# EAGLE design LCD_Disp_AIR (EAGLE 6.5.0)
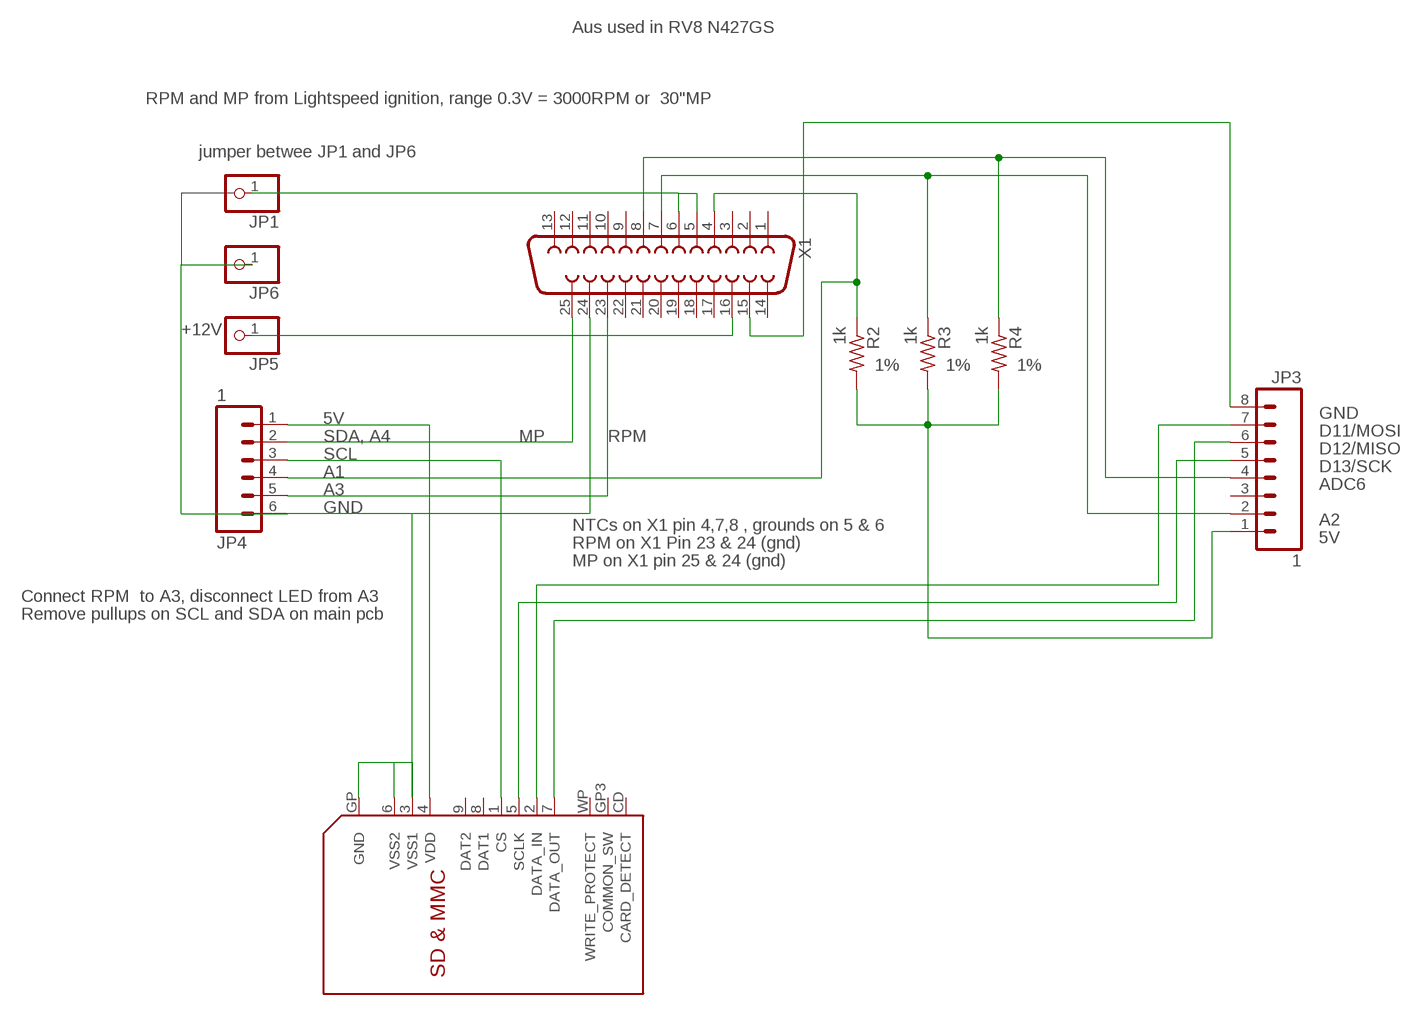
[diagram p0: schematic, sheet 1]

## Parts
JP1  PINHD-1X1CB  [1X01-CLEANBIG]
JP3  1  M081X08  [1X08]
JP4  1  M06SIP  [1X06]
JP5  PINHD-1X1  [1X01]
JP6  PINHD-1X1CB  [1X01-CLEANBIG]
R2  1k  R-US_0204/7  [0204/7]
R3  1k  R-US_0204/7  [0204/7]
R4  1k  R-US_0204/7  [0204/7]
U$1  SDMMC06132  [06132]
X1  DB25_FEMALEVB  [F25VB]

## Nets
+12V: JP5.1 X1.16
GND: JP4.6 JP6.1 U$1.3(VSS1) U$1.6(VSS2) U$1.GP(GND) X1.24
MISO: JP3.6 U$1.7(DATA_OUT)
MOSI: JP3.7 U$1.2(DATA_IN)
N$2: JP1.1 X1.5 X1.6
N$3: JP3.1 R2.2 R3.2 R4.2
N$4: JP3.8 X1.15
N$5: JP4.5 X1.23
N$6: JP4.2 X1.25
N$8: JP3.2 R3.1 X1.7
N$9: JP3.4 R4.1 X1.8
N$10: JP4.4 R2.1 X1.4
SCI_SD_SS: JP4.3 U$1.1(CS)
SCLK: JP3.5 U$1.5(SCLK)
VDD: JP4.1 U$1.4(VDD)
Unconnected: JP3.3 U$1.8(DAT1) U$1.9(DAT2) U$1.CD(CARD_DETECT) U$1.GP3(COMMON_SW) U$1.WP(WRITE_PROTECT) X1.1 X1.2 X1.3 X1.9 X1.10 X1.11 X1.12 X1.13 X1.14 X1.17 X1.18 X1.19 X1.20 X1.21 X1.22

## Notes on the sheet
- Aus used in RV8 N427GS
- RPM and MP from Lightspeed ignition, range 0.3V = 3000RPM or  30"MP
- jumper betwee JP1 and JP6
- 1% | 1% | 1%
- GND
- 5V | D11/MOSI
- SDA, A4 | MP | RPM | D12/MISO
- SCL | D13/SCK
- A1 | ADC6
- A3
- GND | A2
- NTCs on X1 pin 4,7,8 , grounds on 5 & 6 | 5V
- RPM on X1 Pin 23 & 24 (gnd)
- MP on X1 pin 25 & 24 (gnd)
- Connect RPM  to A3, disconnect LED from A3
- Remove pullups on SCL and SDA on main pcb

## Library data of the parts
JP1 JP5 JP6 = adafruit:PINHD-1X1: Pin header 1x1 for 0.1" spacing With round pins
JP3 = SparkFun-Connectors:M08: Header 8 Standard 8-pin 0.1" header. Use with straight break away headers (SKU : PRT-00116), right angle break away headers (PRT-00553), swiss pins (PRT-00743), machine pins (PRT-00117), and female headers (PRT-00115).
JP4 = SparkFun-Connectors:M06: Header 6 Standard 6-pin 0.1" header. Use with straight break away headers (SKU : PRT-00116), right angle break away headers (PRT-00553), swiss pins (PRT-00743), machine pins (PRT-00117), and female headers (PRT-00115). Molex polarized connector foot print use with SKU : PRT-08094 with associated crimp pins and housings. NOTES ON THE VARIANTS LOCK and LOCK_LONGPADS... This footprint was designed to help hold the alignment of a through-hole component (i.e. 6-pin header) while soldering it into place. You may notice that each hole has been shifted either up or down by 0.005 of an inch from it's more standard position (which is a perfectly straight line). This slight alteration caused the pins (the squares in the middle) to touch the edges of the holes. Because they are alternating, it causes a "brace" to hold the component in place. 0.005 has proven to be the perfect amount of "off-center" position when using our standard breakaway headers. Although looks a little odd when you look at the bare footprint, once you have a header in there, the alteration is very hard to notice. Also, if you push a header all the way into place, it is covered up entirely on the bottom side. This idea of altering the position of holes to aid alignment will be further integrated into the Sparkfun Library for other footprints. It can help hold any component with 3 or more connection pins.
R2-R4 = resistor:R-US_: RESISTOR, American symbol
U$1 = adafruit:SDMMC: SD MMC Card holder 4UCON part #06132 - easy to solder
X1 = SparkFun-Retired:DB25_FEMALE: 25 Pin male connector. PCB edge mount for regular PCB thicknesses. This connector will connect directly to the back of a PC parallel port or through a normal DB25 extension cable (M/F). SKU: PRT-08287

## Net classes
1 vcc: width 0.254 mm

## Board
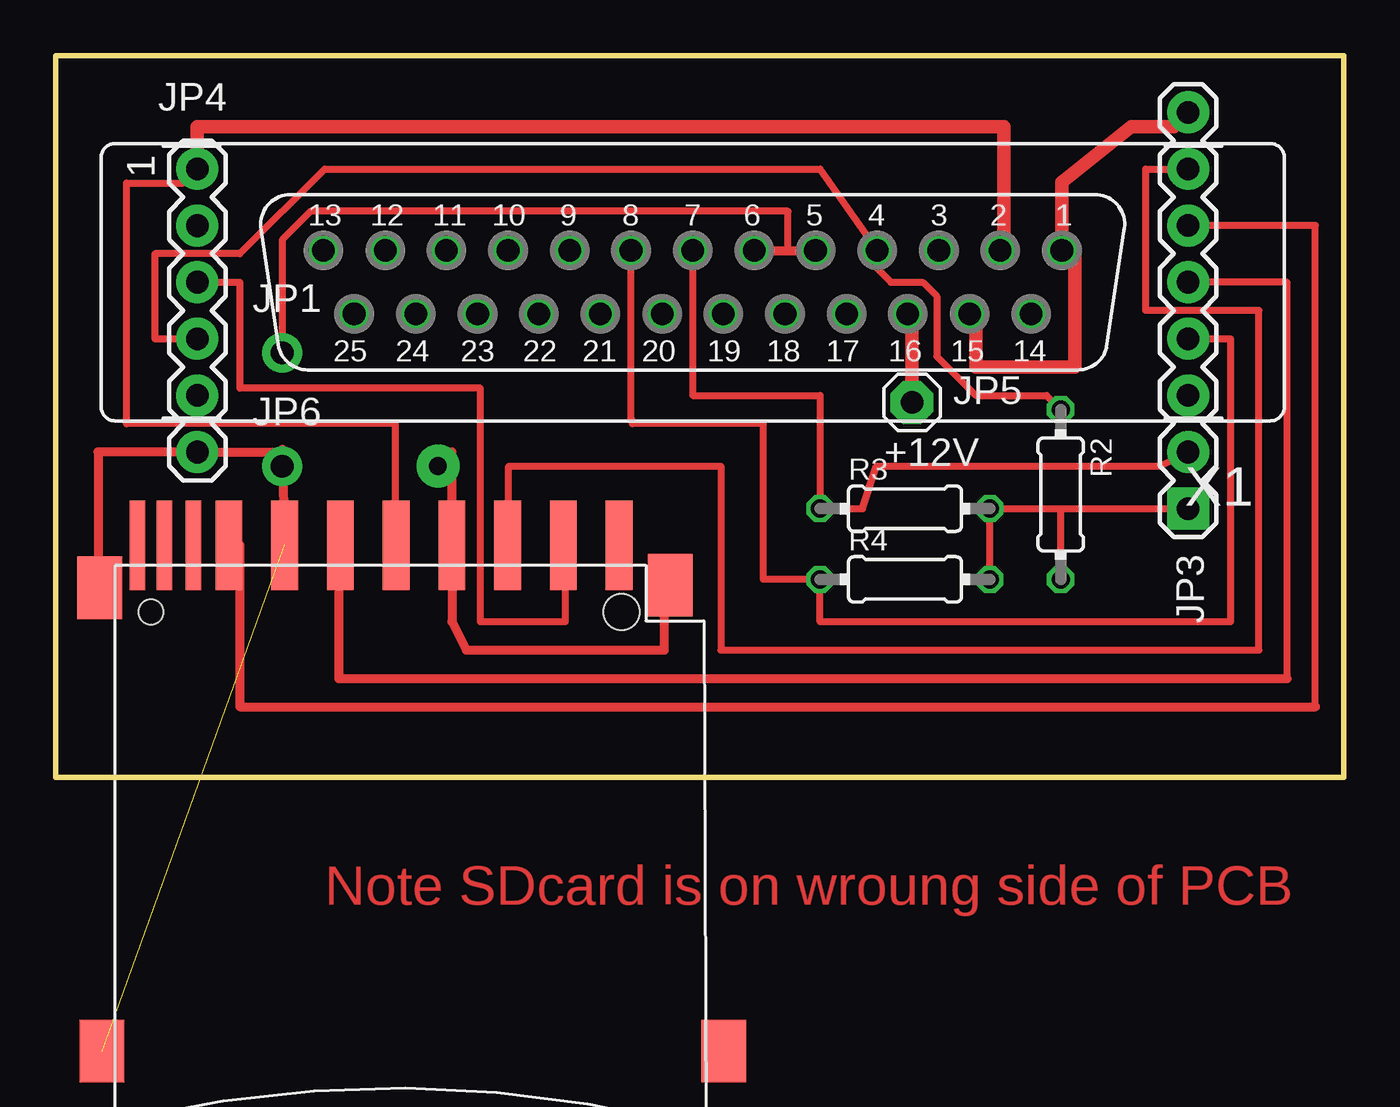
[diagram p1: board, top side]
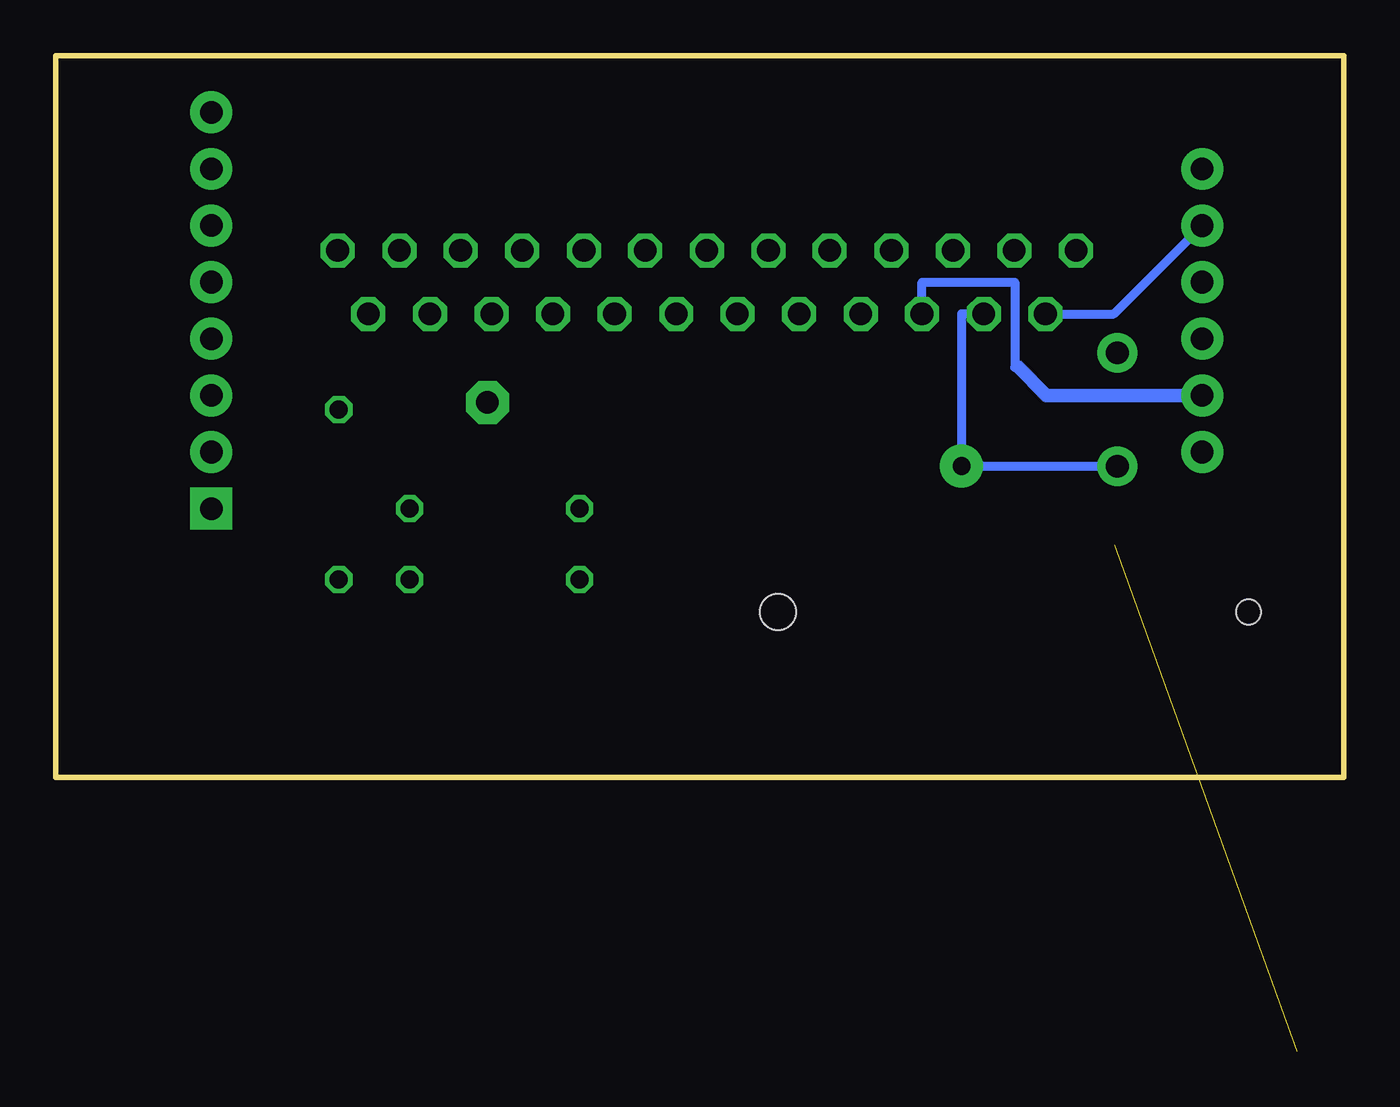
[diagram p2: board, bottom side, seen from below]

Size 57.78 x 32.38 mm. Coordinates in mm from the lower left corner, seen from the top.
Outline: 0,0 57.78,0 57.78,32.38 0,32.38 0,0
Copper layers (1*16): Top 0.0356mm / dielectric 1.5011mm / Bottom 0.0356mm
Design rules "OSH": minimum track width 6mil, minimum drill 13mil, track to track 6mil, track to pad 6mil, pad to pad 6mil, via to via 6mil, smd to smd 6mil, copper to edge 15mil, drill to drill 6mil, minimum pad ring 7mil, minimum via ring 7mil, stop-mask expansion 3mil, vias tented up to drill 0mil, thermal gap 10mil

### Footprints (pad centres in the part's own frame; a part is rotated, then mirrored left to right if it is on the bottom)
1X01-CLEANBIG = drill 1.016 pad 1.778: 1 0,0
1X08 = drill 1.016 pad 1.88 square: 1 0,0 | drill 1.016 pad 1.88: 2 2.54,0; 3 5.08,0; 4 7.62,0; 5 10.16,0; 6 12.7,0; 7 15.24,0; 8 17.78,0
1X06 = drill 1.016 pad 1.88: 1 0,0; 2 2.54,0; 3 5.08,0; 4 7.62,0; 5 10.16,0; 6 12.7,0
1X01 = drill 1.016 pad 1.93 octagon: 1 0,0
0204/7 = drill 0.813 octagon: 1 -3.81,0; 2 3.81,0
06132 = smd 1.2 x 4: 1 6.9,0.9; 2 4.4,0.9; 3 1.9,0.9; 4 -0.6,0.9; 5 -3.1,0.9; 6 -5.6,0.9; 7 -8.1,0.9; 9 9.4,0.9 | smd 0.7 x 4: 8 -9.7,0.9; CD -11,0.9; WP -12.2,0.9 | smd 2 x 2.8: GP -13.8,-21.8; GP2 14.1,-21.8; GP3 11.7,-0.9; GP4 -13.9,-1 | hole 1.1: -11.6,-2.1 | hole 1.6: 9.5,-2.1
F25VB = drill 1.016 octagon: 1 -16.561,-1.422; 2 -13.792,-1.422; 3 -11.049,-1.422; 4 -8.28,-1.422; 5 -5.512,-1.422; 6 -2.769,-1.422; 7 0,-1.422; 8 2.769,-1.422; 9 5.512,-1.422; 10 8.28,-1.422; 11 11.049,-1.422; 12 13.792,-1.422; 13 16.561,-1.422; 14 -15.189,1.422; 15 -12.421,1.422; 16 -9.652,1.422; 17 -6.909,1.422; 18 -4.14,1.422; 19 -1.372,1.422; 20 1.372,1.422; 21 4.14,1.422; 22 6.909,1.422; 23 9.652,1.422; 24 12.421,1.422; 25 15.189,1.422

### Placement (x,y rotation side)
JP1  10.16,19.05 0 top
JP3  50.8,12.07 90 top
JP4  6.35,27.3 270 top
JP5  38.42,16.83 0 top
JP6  10.16,13.97 0 top
R2  45.09,12.7 270 top
R3  38.1,12.06 0 top
R4  38.1,8.89 0 top
U$1  15.88,9.53 0 top
X1  28.57,22.23 180 top

### Tracks (layer width: path | path; a pad name or v marks a point on that pad's centre or on a via)
+12V
  Top 0.61: X1.16 38.42,20.61 JP5.1
GND  (via drill 0.8 pad 1.93)  (1 unrouted)
  Top 0.254: U$1.6 10.28,13.97 | 17.78,11.06 U$1.3
  Top 0.305: JP6.1 10.16,14.6
  Top 0.406: JP4.6 10.16,14.6 10.16,14.72 U$1.6 | 27.3,9.53 27.3,5.71 18.41,5.71 17.78,6.98 17.78,11.05 U$1.3 17.78,14.6 v17.14,13.97
  Bottom 0.406: JP6.1 v17.14,13.97 17.14,20.8 X1.24
MISO
  Top 0.305: 56.52,3.17 56.52,24.77 JP3.6
  Top 0.406: U$1.7 8.26,10.42 8.26,3.17 56.52,3.17 | JP3.6
MOSI
  Top 0.305: 48.89,27.3 48.89,20.95 53.98,20.95 53.98,5.71 29.84,5.71 29.84,13.97 20.32,13.97 20.32,11.06 | 48.89,27.3 | 48.89,27.3 JP3.7
  Top 0.406: U$1.2 20.32,11.06
N$1
  Top 0.406: 6.35,14.6 1.91,14.6 1.91,8.89 1.27,8.89
N$2
  Top 0.305: 32.86,23.65 32.86,25.4 11.43,25.4 10.16,24.13 JP1.1
  Top 0.406: X1.6 32.86,23.65 X1.5
N$3
  Top 0.305: R4.2 R3.2 | R3.2 | R3.2 45.09,12.06 | 45.09,12.06 JP3.1 | R2.2 45.09,12.06
N$4
  Top 0.61: X1.15 41.27,20.52 41.27,18.41 45.72,18.41 45.72,23.5 45.14,24.08 45.14,26.72 48.26,29.21 50.17,29.21 JP3.8
N$5
  Bottom 0.406: X1.23 18.92,22.23 18.41,22.23 14.76,22.23 14.76,18.41 14.61,18.41
  Bottom 0.61: JP4.5 13.33,17.14 14.61,18.41
N$6
  Bottom 0.406: X1.25 10.32,20.8 JP4.2
N$8
  Top 0.305: JP3.2 49.53,13.97 36.83,13.97 36.2,12.06 R3.1 34.29,17.14 28.57,17.14 X1.7
N$9
  Top 0.305: JP3.4 52.7,19.69 52.7,6.98 34.29,6.98 R4.1 31.75,8.89 31.75,15.87 25.88,15.87 25.88,16.03 25.81,16.03 X1.8
N$10
  Top 0.305: JP4.4 4.44,19.69 4.44,23.5 8.26,23.5 12.07,27.3 34.29,27.3 X1.4 36.85,22.84 37.46,22.23 38.89,22.23 39.53,21.59 39.53,18.89 41.27,17.14 44.45,17.14 R2.1
SCI_SD_SS
  Top 0.305: U$1.1 22.86,10.97 22.86,6.98 19.05,6.98 19.05,17.46 8.26,17.46 8.26,22.23 8.25,22.22 JP4.3
SCLK
  Top 0.305: 55.24,4.44 55.24,22.23 JP3.5
  Top 0.406: U$1.5 12.7,10.42 12.7,4.44 55.24,4.44 | JP3.5
VDD
  Top 0.254: U$1.4 15.24,11.06
  Top 0.305: 15.24,11.06 15.24,15.87 3.17,15.87 3.17,26.67 5.72,26.67 JP4.1
  Top 0.61: 42.55,23.83 42.55,29.21 6.35,29.21 JP4.1

### Text on the board
Top: Note SDcard is on wroung side of PCB
tPlace: +12V